# EAGLE design top (EAGLE 5.10)
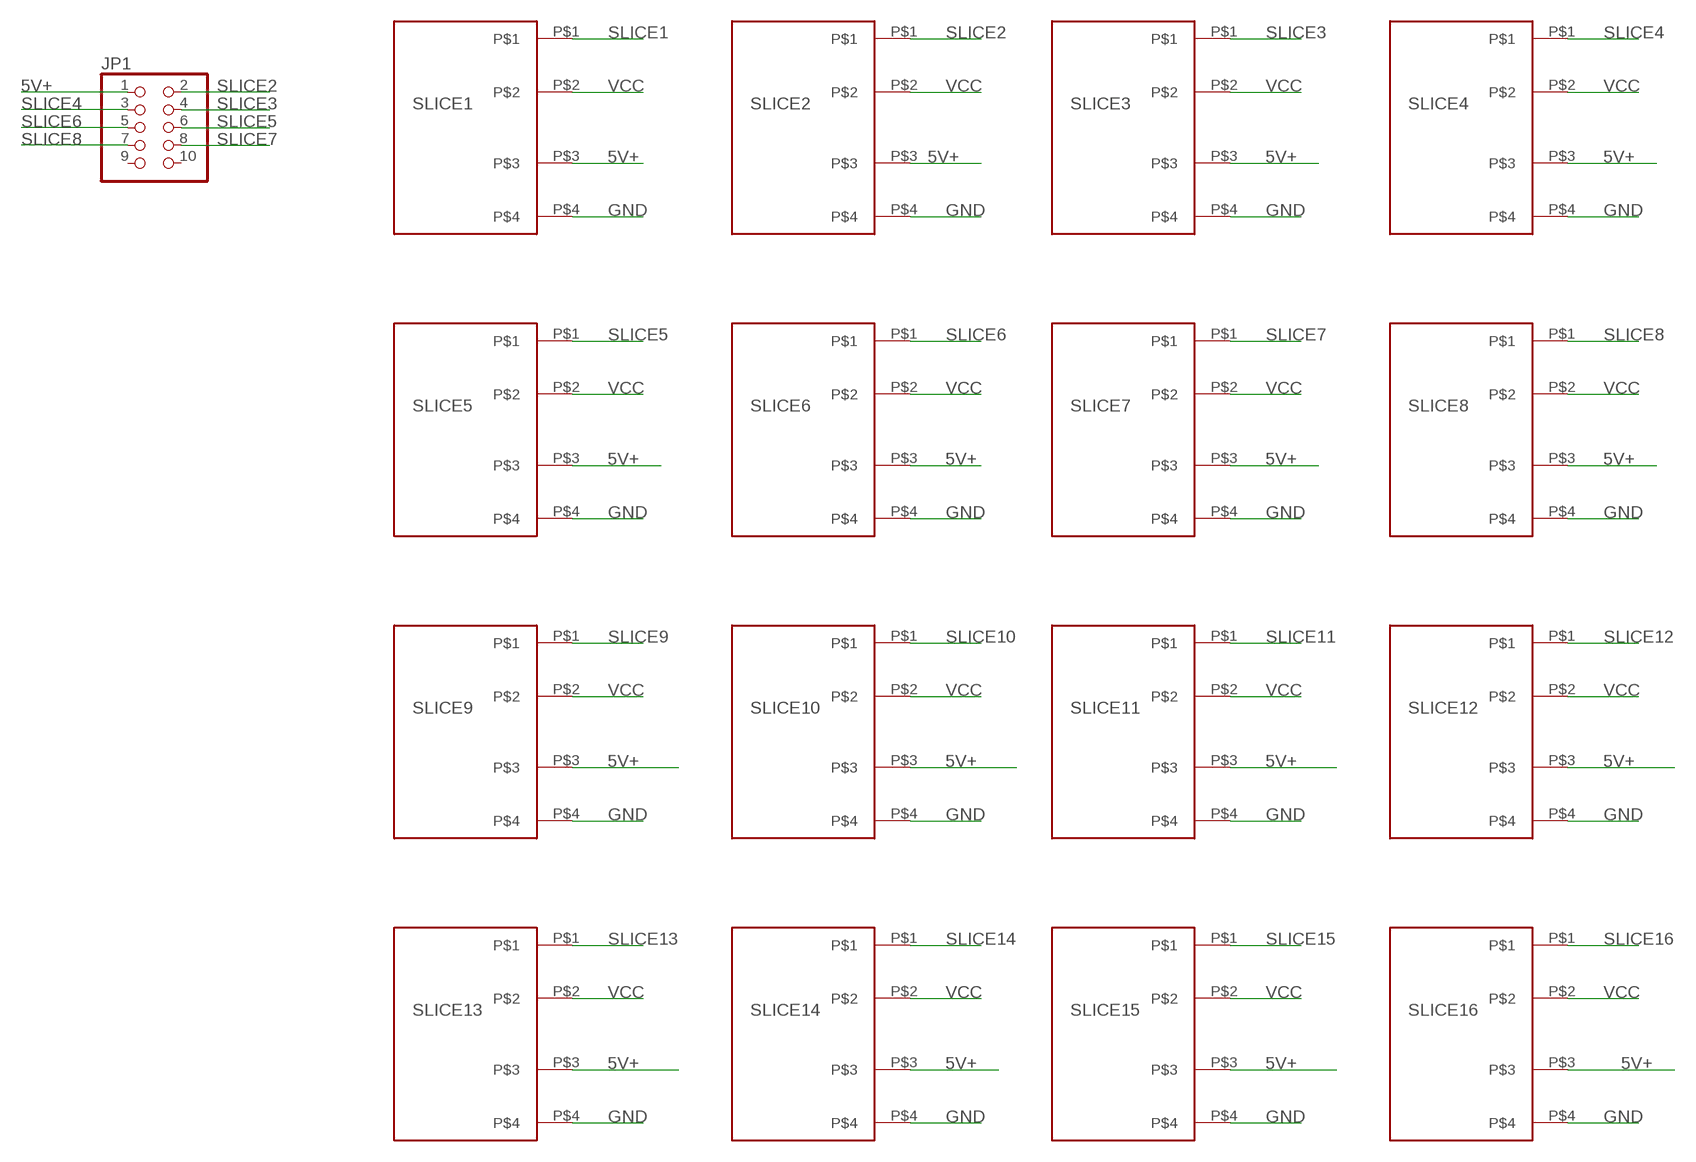
[diagram p0: schematic, sheet 1]

## Parts
JP1  PINHD-2X5  [2X05]
SLICE1  SLICE_SOCKET  [SLICE_SOCKET]
SLICE2  SLICE_SOCKET  [SLICE_SOCKET]
SLICE3  SLICE_SOCKET  [SLICE_SOCKET]
SLICE4  SLICE_SOCKET  [SLICE_SOCKET]
SLICE5  SLICE_SOCKET  [SLICE_SOCKET]
SLICE6  SLICE_SOCKET  [SLICE_SOCKET]
SLICE7  SLICE_SOCKET  [SLICE_SOCKET]
SLICE8  SLICE_SOCKET  [SLICE_SOCKET]
SLICE9  SLICE_SOCKET  [SLICE_SOCKET]
SLICE10  SLICE_SOCKET  [SLICE_SOCKET]
SLICE11  SLICE_SOCKET  [SLICE_SOCKET]
SLICE12  SLICE_SOCKET  [SLICE_SOCKET]
SLICE13  SLICE_SOCKET  [SLICE_SOCKET]
SLICE14  SLICE_SOCKET  [SLICE_SOCKET]
SLICE15  SLICE_SOCKET  [SLICE_SOCKET]
SLICE16  SLICE_SOCKET  [SLICE_SOCKET]

## Nets
5V+: JP1.1 SLICE1.P$3 SLICE2.P$3 SLICE3.P$3 SLICE4.P$3 SLICE5.P$3 SLICE6.P$3 SLICE7.P$3 SLICE8.P$3 SLICE9.P$3 SLICE10.P$3 SLICE11.P$3 SLICE12.P$3 SLICE13.P$3 SLICE14.P$3 SLICE15.P$3 SLICE16.P$3
GND: SLICE1.P$4 SLICE2.P$4 SLICE3.P$4 SLICE4.P$4 SLICE5.P$4 SLICE6.P$4 SLICE7.P$4 SLICE8.P$4 SLICE9.P$4 SLICE10.P$4 SLICE11.P$4 SLICE12.P$4 SLICE13.P$4 SLICE14.P$4 SLICE15.P$4 SLICE16.P$4
SLICE1: SLICE1.P$1
SLICE2: JP1.2 SLICE2.P$1
SLICE3: JP1.4 SLICE3.P$1
SLICE4: JP1.3 SLICE4.P$1
SLICE5: JP1.6 SLICE5.P$1
SLICE6: JP1.5 SLICE6.P$1
SLICE7: JP1.8 SLICE7.P$1
SLICE8: JP1.7 SLICE8.P$1
SLICE9: SLICE9.P$1
SLICE10: SLICE10.P$1
SLICE11: SLICE11.P$1
SLICE12: SLICE12.P$1
SLICE13: SLICE13.P$1
SLICE14: SLICE14.P$1
SLICE15: SLICE15.P$1
SLICE16: SLICE16.P$1
VCC: SLICE1.P$2 SLICE2.P$2 SLICE3.P$2 SLICE4.P$2 SLICE5.P$2 SLICE6.P$2 SLICE7.P$2 SLICE8.P$2 SLICE9.P$2 SLICE10.P$2 SLICE11.P$2 SLICE12.P$2 SLICE13.P$2 SLICE14.P$2 SLICE15.P$2 SLICE16.P$2
Unconnected: JP1.9 JP1.10

## Library data of the parts
JP1 = pinhead:PINHD-2X5: PIN HEADER
SLICE1-SLICE16 = slice:SLICE_SOCKET

## Board
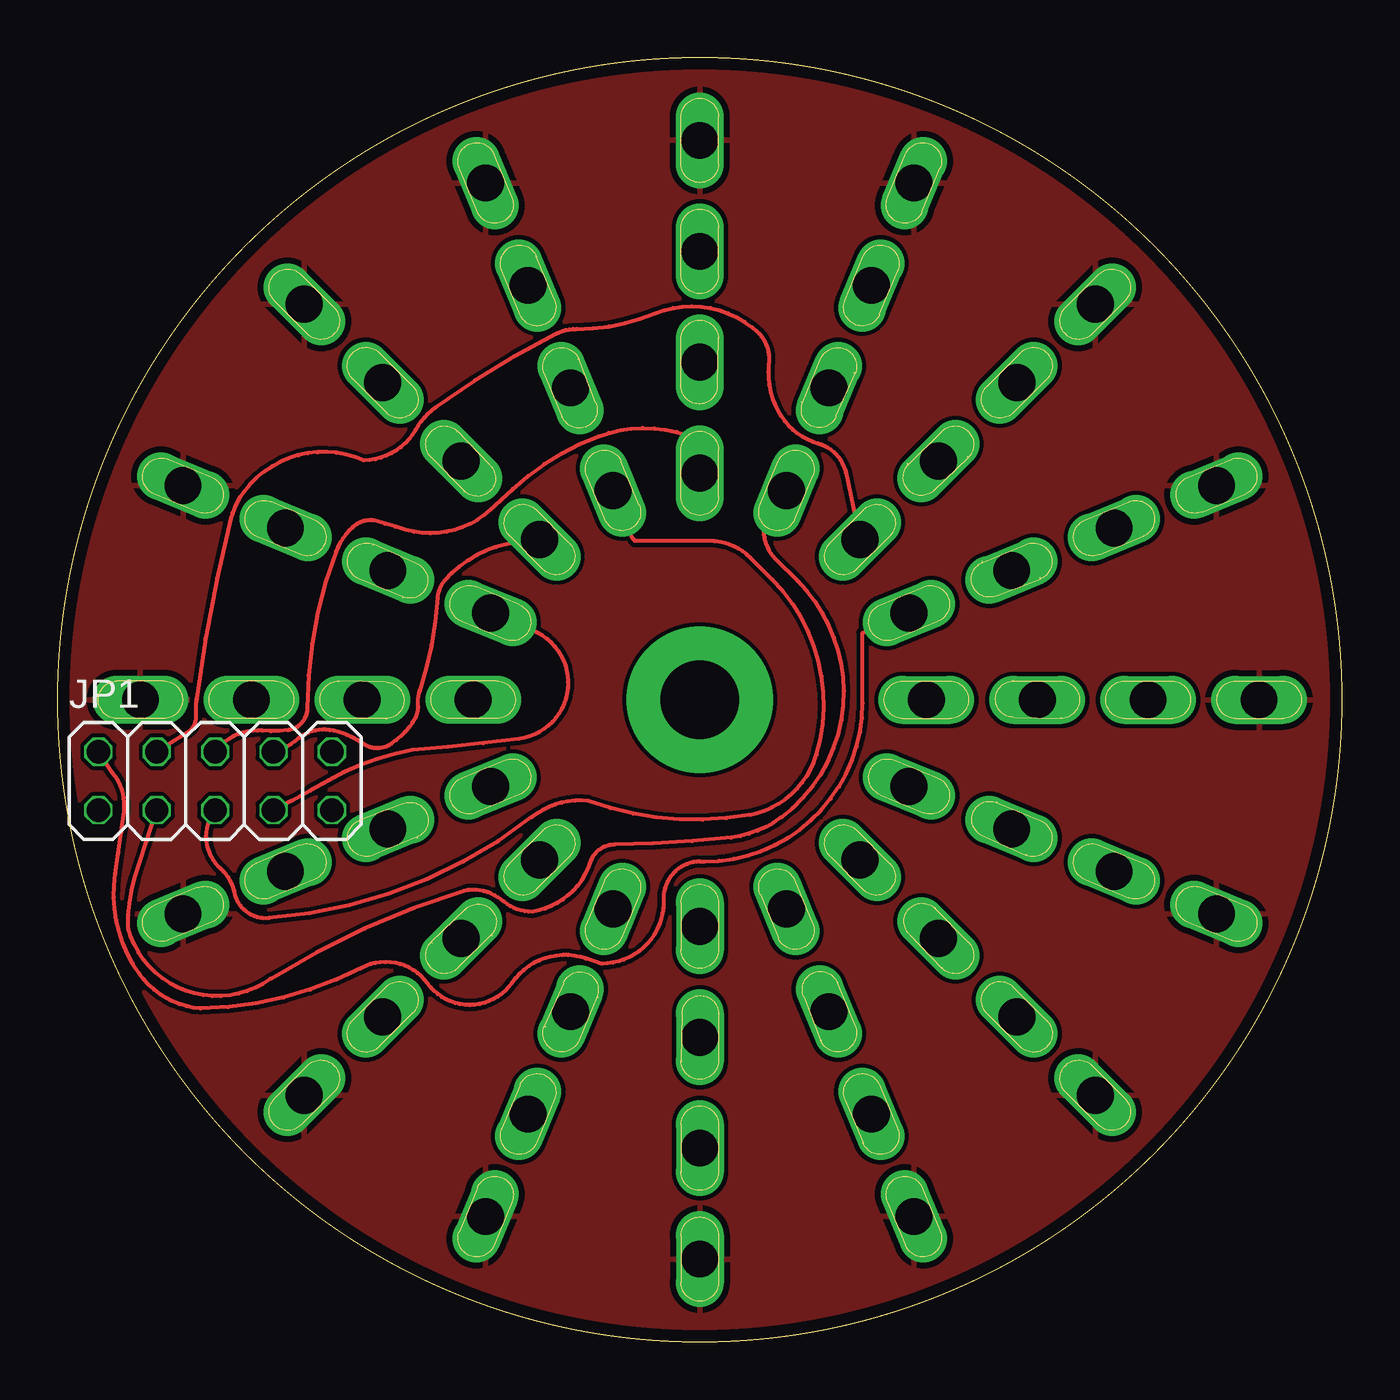
[diagram p1: board, top side]
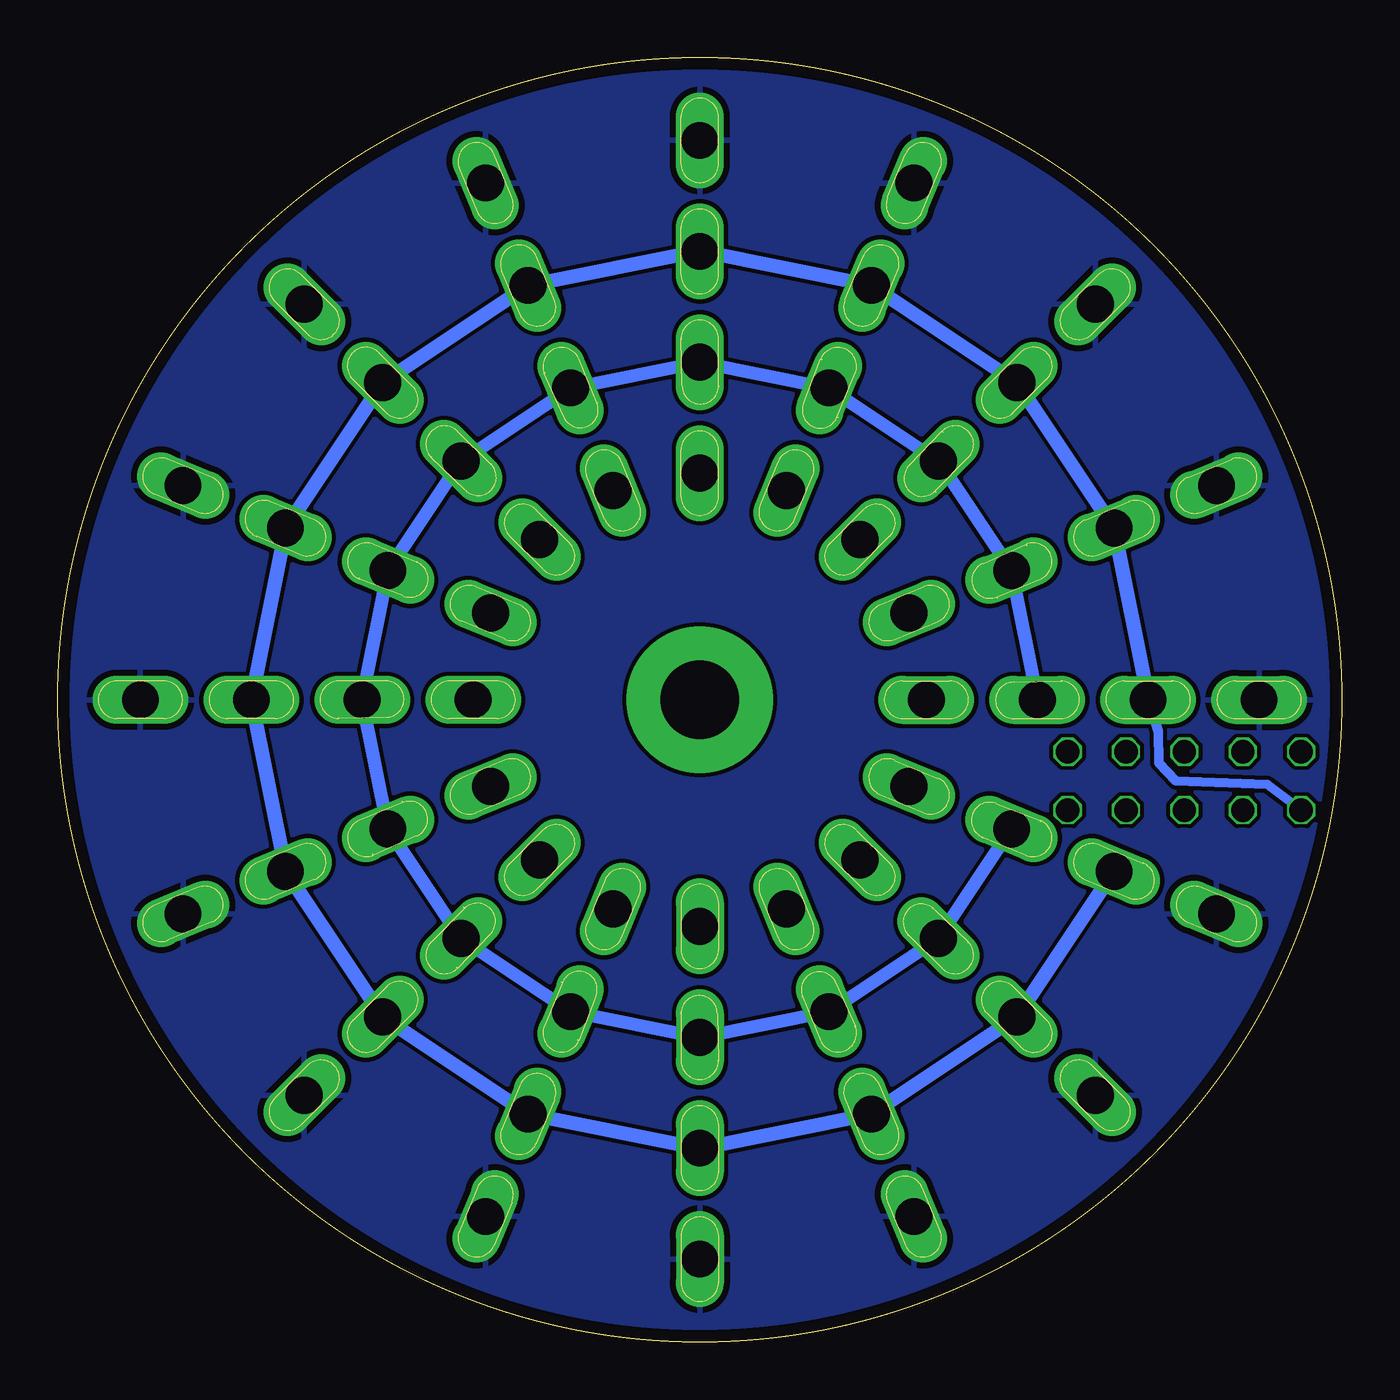
[diagram p2: board, bottom side, seen from below]

Size 55.88 x 55.88 mm. Coordinates in mm from the lower left corner, seen from the top.
Outline: circle at 27.94,27.94 radius 27.94
Copper layers (1*16): Top 0.0356mm / dielectric 1.5011mm / Bottom 0.0356mm
Design rules "SilverCircuits *": minimum track width 7mil, minimum drill 14mil, track to track 7mil, track to pad 7mil, pad to pad 7mil, via to via 7mil, smd to smd 0mil, copper to edge 20mil, drill to drill 8mil, minimum pad ring 0mil, minimum via ring 8mil, stop-mask expansion 4mil, vias tented up to drill 0mil, thermal gap 10mil

### Footprints (pad centres in the part's own frame; a part is rotated, then mirrored left to right if it is on the bottom)
2X05 = drill 1.016 octagon: 1 -5.08,-1.27; 2 -5.08,1.27; 3 -2.54,-1.27; 4 -2.54,1.27; 5 0,-1.27; 6 0,1.27; 7 2.54,-1.27; 8 2.54,1.27; 9 5.08,-1.27; 10 5.08,1.27
SLICE_SOCKET = drill 1.6 pad 2.095 long: P$1 0,0; P$2 4.826,0; P$3 9.652,0; P$4 14.478,0

### Placement (x,y rotation side)
JP1  6.86,24.41 0 top
SLICE1  37.8,27.94 0 top
SLICE2  37.05,31.71 22.5 top
SLICE3  34.91,34.91 45 top
SLICE4  31.71,37.05 67.5 top
SLICE5  27.94,37.8 90 top
SLICE6  24.17,37.05 112.5 top
SLICE7  20.97,34.91 135 top
SLICE8  18.84,31.71 157.5 top
SLICE9  18.08,27.94 180 top
SLICE10  18.84,24.17 202.5 top
SLICE11  20.97,20.97 225 top
SLICE12  24.17,18.84 247.5 top
SLICE13  27.94,18.08 270 top
SLICE14  31.71,18.84 292.5 top
SLICE15  34.91,20.97 315 top
SLICE16  37.05,24.17 337.5 top

### Tracks (layer width: path | path; a pad name or v marks a point on that pad's centre or on a via)
5V+
  Bottom 0.406: JP1.1 3.25,24.26 7.24,24.41 7.98,25.2 8,26.57 SLICE9.P$3
  Bottom 0.61: SLICE9.P$3 SLICE8.P$3 SLICE7.P$3 SLICE6.P$3 SLICE5.P$3 SLICE4.P$3 SLICE3.P$3 SLICE2.P$3 SLICE1.P$3 SLICE16.P$3 SLICE15.P$3 SLICE14.P$3 SLICE13.P$3 SLICE12.P$3 SLICE11.P$3 SLICE10.P$3
GND
  pour Top: 12.29,52.98 arc90 1.45,15.11 arc90 42.24,0.64 arc90 53.57,45.64 arc90
  pour Bottom: 10.97,51.87 arc90 0.13,14 arc90 40.92,-0.48 arc90 52.25,44.53 arc90
N$1  (via drill 3.43 pad 6.35)
  other vias: 27.94,27.94
SLICE2
  Top 0.178: SLICE2.P$1 35.03,30.84 35.03,27.79 arc-90 28.14,20.9 27.96,20.9 arc90 26.37,19.3 26.37,19.15 arc-90 23.67,16.46 22.99,16.69 arc73 19.76,15.62 arc-109 16.1,15.6 arc82 13.23,16.28 arc-26 6.22,14.5 arc-49 3.56,16.03 arc-44 2.52,20.37 arc1 2.9,23.09 arc47 2.41,24.74 JP1.2
SLICE3
  Top 0.178: SLICE3.P$1 34.29,37.82 arc62 33.1,39.09 arc-41 31.5,40.26 arc-38 30.94,42.49 arc51 30.53,43.87 arc66 26.01,44.76 arc-23 22.58,44.07 arc28 21.69,43.87 arc9 16.46,40.66 arc24 15.57,39.67 arc-59 13.34,38.35 arc77 8.1,36.98 arc23 7.54,35.81 arc7 6.05,27.99 arc11 6.02,27.25 arc-65 5.59,26.47 JP1.4
SLICE4
  Top 0.178: SLICE4.P$1 30.73,35.31 arc45 31.26,34.05 32.21,33.1 arc-44 34.21,28.32 arc-54 31.5,22.84 arc-29 29.31,21.95 arc-5 24.23,21.64 arc71 23.16,20.85 arc-63 20.65,18.72 arc-43 19.3,19.25 arc49 17.7,19.63 arc15 9.27,15.8 arc-111 3.07,18.01 arc-16 3.35,20.19 JP1.3
SLICE5
  Top 0.178: JP1.6 arc-58 8.92,26.59 arc12 10.03,26.62 arc39 10.57,26.87 arc45 10.87,27.61 arc-21 12.12,34.39 arc-28 12.85,35.46 arc-50 13.79,35.74 arc1 15.16,35.33 arc59 18.82,36.2 19.81,37.11 arc-22 23.52,39.4 arc-40 27.41,39.45 arc-106 SLICE5.P$1
SLICE6
  Top 0.178: SLICE6.P$1 24.89,35.2 arc23 25.12,34.85 28.36,34.85 arc-45 30.16,34.11 31.09,33.17 arc-62 33.02,25.55 arc-63 30.1,22.94 arc-30 23.09,23.55 arc43 20.62,22.84 arc-33 9.2,18.44 arc-82 7.72,19.48 arc40 7.11,20.57 arc-85 JP1.5
SLICE7
  Top 0.178: SLICE7.P$1 19.94,34.77 arc41 16.84,33.12 arc38 16.54,32.39 arc-15 15.75,28.32 arc23 15.67,27.71 arc-34 15.57,27.18 arc-29 14.53,26.04 arc-71 13.34,26.01 arc21 12.01,26.59 arc51 10.49,26.26 arc-25 JP1.8
SLICE8
  Top 0.178: SLICE8.P$1 20.68,30.96 arc-150 20.07,26.24 arc-3 15.44,25.76 arc18 11.79,24.44 arc-4 JP1.7
VCC
  Bottom 0.559: SLICE9.P$2 SLICE8.P$2 SLICE7.P$2 SLICE6.P$2 SLICE5.P$2 SLICE4.P$2 SLICE3.P$2 SLICE2.P$2 SLICE1.P$2 SLICE16.P$2 SLICE15.P$2 SLICE14.P$2 SLICE13.P$2 SLICE12.P$2 SLICE11.P$2 SLICE10.P$2

### Text on the board
Document: RAD_330